# Altium project LimeSDR-XTRX_1v3.PrjPcb (part 7 of 8)

## Sheet 11_Power.SchDoc: Power
size A3; Organization: Lime Microsystems; Address1: Surrey Tech Centre; Address2: Guildford GU2 7YG; Address3: Surrey; Address4: United Kingdom; Revision: v1.3; SheetNumber: 11; SheetTotal: 11
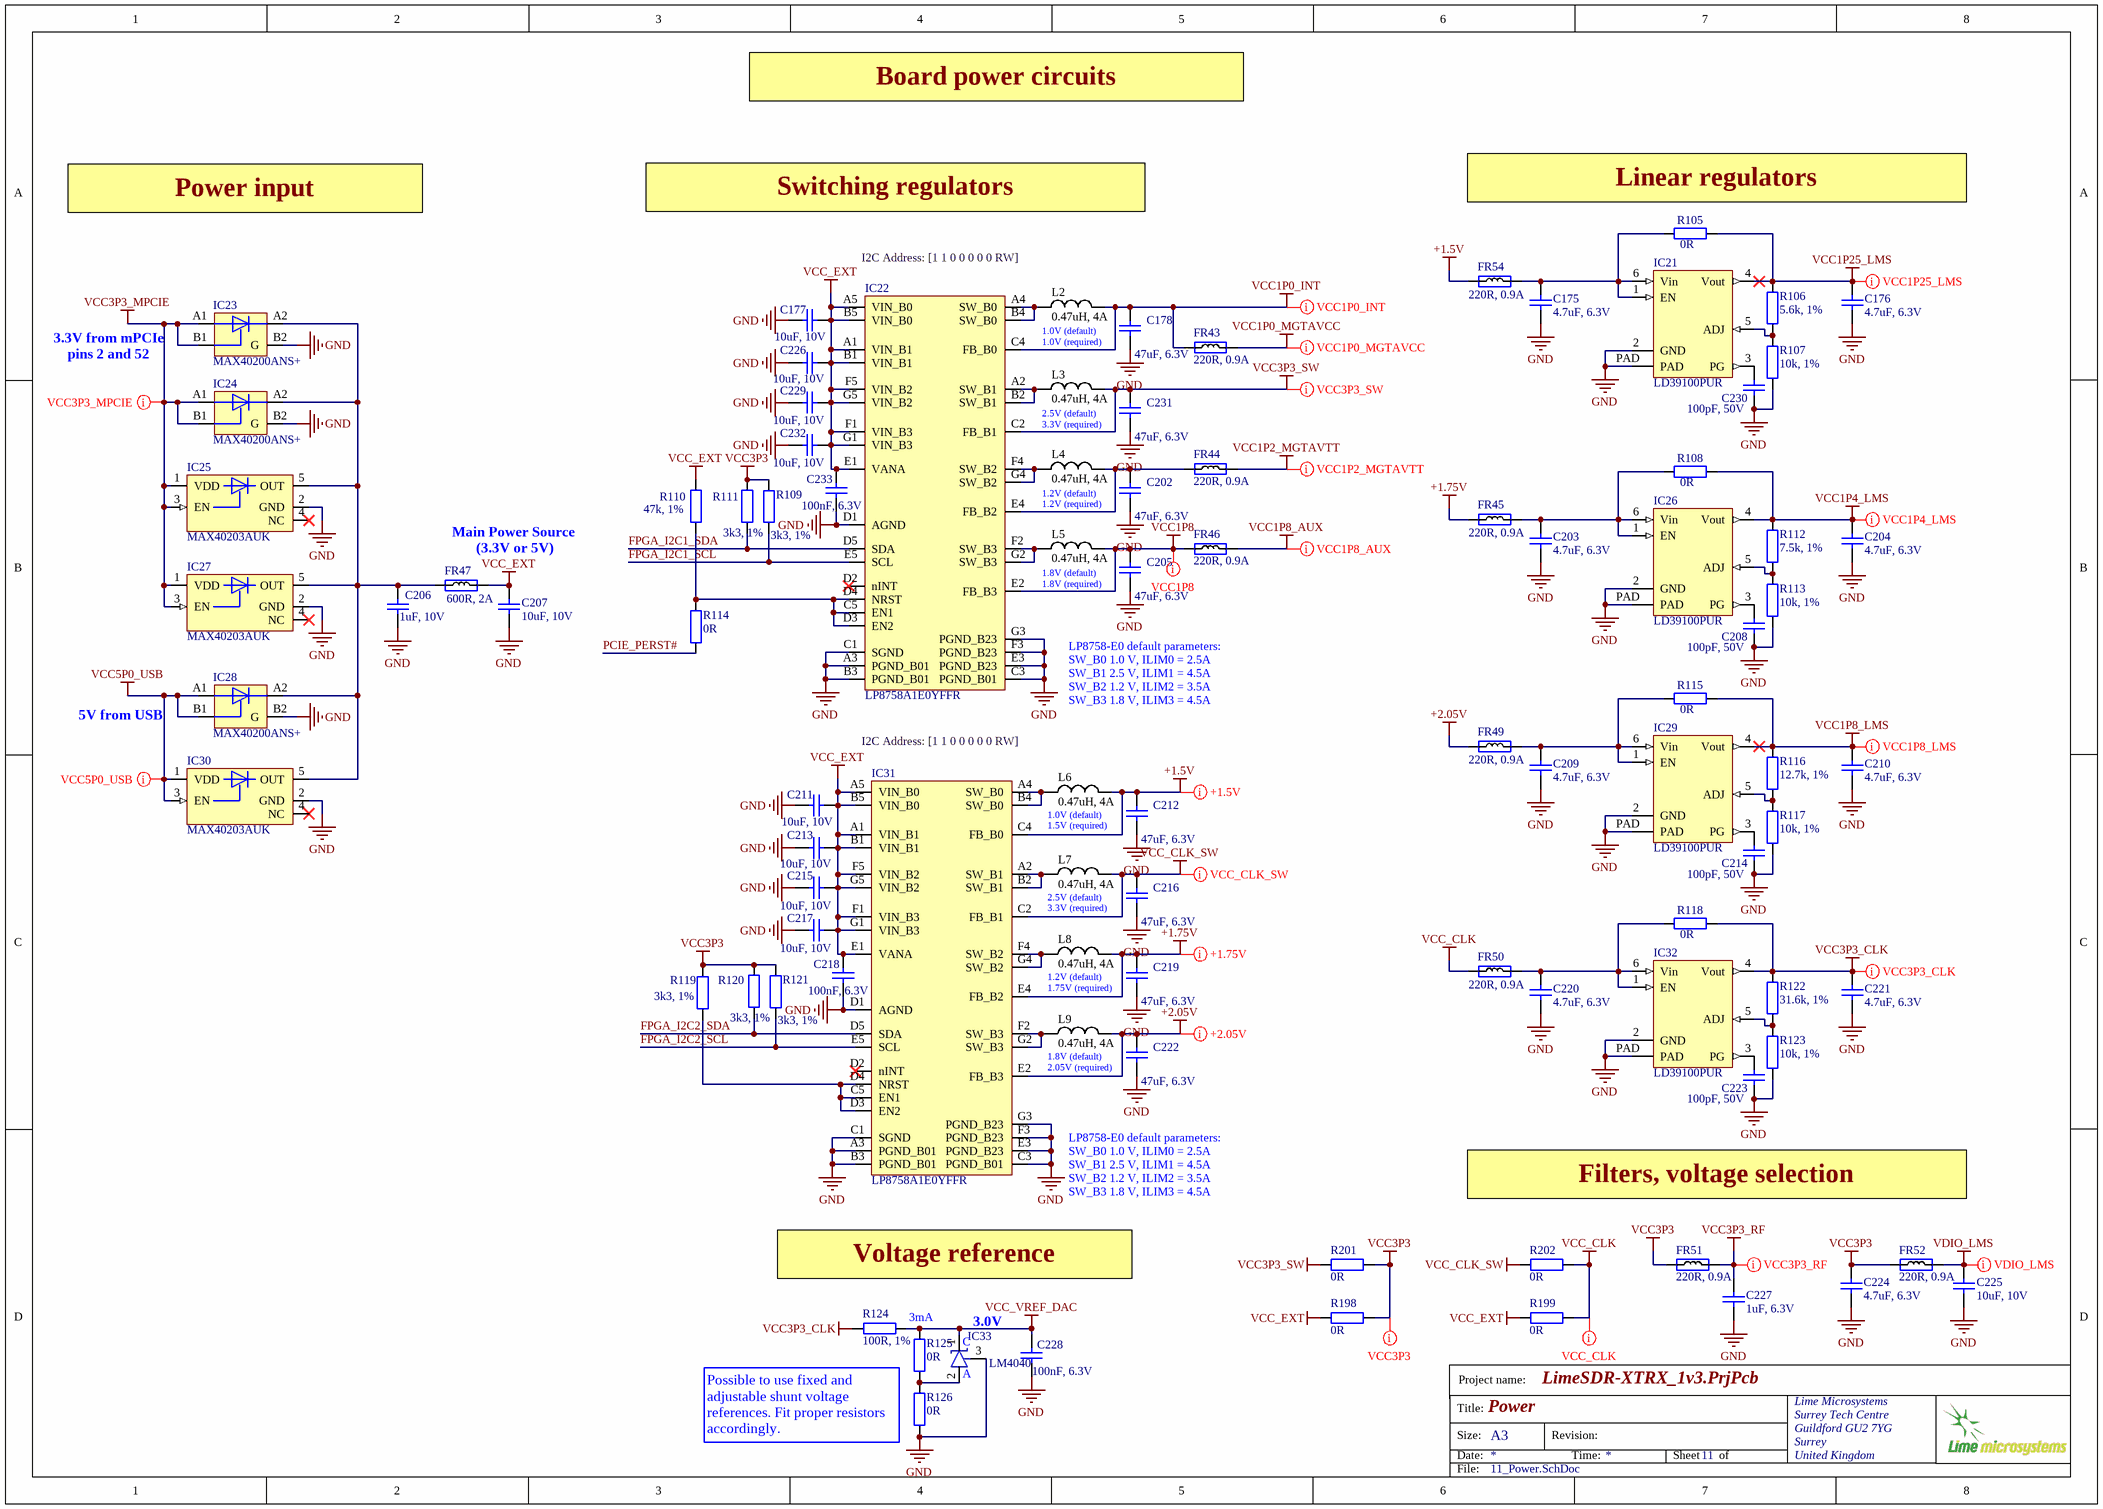
[diagram p10: 11_Power.SchDoc]

### Parts
C175  4.7uF, 6.3V  [CAP0402]
C176  4.7uF, 6.3V  [CAP0402]
C177  10uF, 10V  [CAP0603]
C178  47uF, 6.3V  [CAP0603]
C202  47uF, 6.3V  [CAP0603]
C203  4.7uF, 6.3V  [CAP0402]
C204  4.7uF, 6.3V  [CAP0402]
C205  47uF, 6.3V  [CAP0603]
C206  1uF, 10V  [CAP0402]
C207  10uF, 10V  [CAP0603]
C208  100pF, 50V  [CAP0201]
C209  4.7uF, 6.3V  [CAP0402]
C210  4.7uF, 6.3V  [CAP0402]
C211  10uF, 10V  [CAP0603]
C212  47uF, 6.3V  [CAP0603]
C213  10uF, 10V  [CAP0603]
C214  100pF, 50V  [CAP0201]
C215  10uF, 10V  [CAP0603]
C216  47uF, 6.3V  [CAP0603]
C217  10uF, 10V  [CAP0603]
C218  100nF, 6.3V  [CAP0201]
C219  47uF, 6.3V  [CAP0603]
C220  4.7uF, 6.3V  [CAP0402]
C221  4.7uF, 6.3V  [CAP0402]
C222  47uF, 6.3V  [CAP0603]
C223  100pF, 50V  [CAP0201]
C224  4.7uF, 6.3V  [CAP0402]
C225  10uF, 10V  [CAP0603]
C226  10uF, 10V  [CAP0603]
C227  1uF, 6.3V  [CAP0201]
C228  100nF, 6.3V  [CAP0201]
C229  10uF, 10V  [CAP0603]
C230  100pF, 50V  [CAP0201]
C231  47uF, 6.3V  [CAP0603]
C232  10uF, 10V  [CAP0603]
C233  100nF, 6.3V  [CAP0201]
FR43  220R, 0.9A  [RES0402]
FR44  220R, 0.9A  [RES0402]
FR45  220R, 0.9A  [RES0402]
FR46  220R, 0.9A  [RES0402]
FR47  600R, 2A  [RES0805]
FR49  220R, 0.9A  [RES0402]
FR50  220R, 0.9A  [RES0402]
FR51  220R, 0.9A  [RES0402]
FR52  220R, 0.9A  [RES0402]
FR54  220R, 0.9A  [RES0402]
IC21  LD39100PUR  [LD39100PUR]
IC22  LP8758A1E0YFFR  [LP8758A1E0YFFR_QUAD_DC-DC_35DSBGA]
IC23  MAX40200ANS+  [MAX40200ANS+_IDEAL_DIODE_4WLP]
IC24  MAX40200ANS+  [MAX40200ANS+_IDEAL_DIODE_4WLP]
IC25  MAX40203AUK  [SOT23-5_v1]
IC26  LD39100PUR  [LD39100PUR]
IC27  MAX40203AUK  [SOT23-5_v1]
IC28  MAX40200ANS+  [MAX40200ANS+_IDEAL_DIODE_4WLP]
IC29  LD39100PUR  [LD39100PUR]
IC30  MAX40203AUK  [SOT23-5_v1]
IC31  LP8758A1E0YFFR  [LP8758A1E0YFFR_QUAD_DC-DC_35DSBGA]
IC32  LD39100PUR  [LD39100PUR]
IC33  LM4040  [SOT23-3_v3]
L2  0.47uH, 4A  [IND0806]
L3  0.47uH, 4A  [IND0806]
L4  0.47uH, 4A  [IND0806]
L5  0.47uH, 4A  [IND0806]
L6  0.47uH, 4A  [IND0806]
L7  0.47uH, 4A  [IND0806]
L8  0.47uH, 4A  [IND0806]
L9  0.47uH, 4A  [IND0806]
R105  0R  [RES0201]
R106  5.6k, 1%  [RES0201]
R107  10k, 1%  [RES0201]
R108  0R  [RES0201]
R109  3k3, 1%  [RES0201]
R110  47k, 1%  [RES0201]
R111  3k3, 1%  [RES0201]
R112  7.5k, 1%  [RES0201]
R113  10k, 1%  [RES0201]
R114  0R  [RES0201]
R115  0R  [RES0201]
R116  12.7k, 1%  [RES0201]
R117  10k, 1%  [RES0201]
R118  0R  [RES0201]
R119  3k3, 1%  [RES0201]
R120  3k3, 1%  [RES0201]
R121  3k3, 1%  [RES0201]
R122  31.6k, 1%  [RES0201]
R123  10k, 1%  [RES0201]
R124  100R, 1%  [RES0201]
R125  0R  [RES0201]
R126  0R  [RES0201]
R198  0R  [RES0402]
R199  0R  [RES0402]
R201  0R  [RES0402]
R202  0R  [RES0402]

### Nets
+1.5V: C212.2 FR54.1 IC31.C4(FB_B0) L6.2
+1.75V: C219.2 FR45.1 IC31.E4(FB_B2) L8.2
+2.05V: C222.2 FR49.1 IC31.E2(FB_B3) L9.2
GND: C175.1 C176.1 C177.1 C178.1 C202.1 C203.1 C204.1 C205.1 C206.1 C207.1 C208.1 C209.1 C210.1 C211.1 C212.1 C213.1 C214.1 C215.1 C216.1 C217.1 C218.2 C219.1 C220.1 C221.1 C222.1 C223.1 C224.1 C225.1 C226.1 C227.2 C228.2 C229.1 C230.1 C231.1 C232.1 C233.2 IC21.2(GND) IC21.PAD IC22.A3(PGND_B01) IC22.B3(PGND_B01) IC22.C1(SGND) IC22.C3(PGND_B01) IC22.D1(AGND) IC22.E3(PGND_B23) IC22.F3(PGND_B23) IC22.G3(PGND_B23) IC23.B2(G) IC24.B2(G) IC25.2(GND) IC26.2(GND) IC26.PAD IC27.2(GND) IC28.B2(G) IC29.2(GND) IC29.PAD IC30.2(GND) IC31.A3(PGND_B01) IC31.B3(PGND_B01) IC31.C1(SGND) IC31.C3(PGND_B01) IC31.D1(AGND) IC31.E3(PGND_B23) IC31.F3(PGND_B23) IC31.G3(PGND_B23) IC32.2(GND) IC32.PAD IC33.3(NC/A) R107.2 R113.2 R117.2 R123.2 R126.2
VCC1P0_INT: C178.2 FR43.1 IC22.C4(FB_B0) L2.2
VCC1P0_MGTAVCC: FR43.2
VCC1P2_MGTAVTT: FR44.2
VCC1P4_LMS: C204.2 IC26.4(Vout) R108.2 R112.1
VCC1P8: C205.2 FR46.1 IC22.E2(FB_B3) L5.2
VCC1P8_AUX: FR46.2
VCC1P8_LMS: C210.2 IC29.4(Vout) R115.2 R116.1
VCC1P25_LMS: C176.2 IC21.4(Vout) R105.2 R106.1
VCC3P3: C224.2 FR51.1 FR52.1 R109.1 R111.1 R119.1 R120.1 R121.1 R198.2 R201.2
VCC3P3_CLK: C221.2 IC32.4(Vout) R118.2 R122.1 R124.2
VCC3P3_MPCIE: IC23.A1(VDD) IC23.B1(EN) IC24.A1(VDD) IC24.B1(EN) IC25.1(VDD) IC25.3(EN) IC27.1(VDD) IC27.3(EN)
VCC3P3_RF: C227.1 FR51.2
VCC3P3_SW: C231.2 IC22.C2(FB_B1) L3.2 R201.1
VCC5P0_USB: IC28.A1(VDD) IC28.B1(EN) IC30.1(VDD) IC30.3(EN)
VCC_CLK: FR50.1 R199.2 R202.2
VCC_CLK_SW: C216.2 IC31.C2(FB_B1) L7.2 R202.1
VCC_EXT: C177.2 C207.2 C211.2 C213.2 C215.2 C217.2 C218.1 C226.2 C229.2 C232.2 C233.1 FR47.2 IC22.A1(VIN_B1) IC22.A5(VIN_B0) IC22.B1(VIN_B1) IC22.B5(VIN_B0) IC22.E1(VANA) IC22.F1(VIN_B3) IC22.F5(VIN_B2) IC22.G1(VIN_B3) IC22.G5(VIN_B2) IC31.A1(VIN_B1) IC31.A5(VIN_B0) IC31.B1(VIN_B1) IC31.B5(VIN_B0) IC31.E1(VANA) IC31.F1(VIN_B3) IC31.F5(VIN_B2) IC31.G1(VIN_B3) IC31.G5(VIN_B2) R110.1 R198.1 R199.1
VCC_VREF_DAC: C228.1 IC33.1(K) R124.1 R125.1
VDIO_LMS: C225.2 FR52.2
FPGA_I2C1_SCL: IC22.E5(SCL) R109.2
FPGA_I2C1_SDA: IC22.D5(SDA) R111.2
FPGA_I2C2_SCL: IC31.E5(SCL) R121.2
FPGA_I2C2_SDA: IC31.D5(SDA) R120.2
PCIE_PERST#: R114.1
NetC175_2: C175.2 FR54.2 IC21.1(EN) IC21.6(Vin) R105.1
NetC202_2: C202.2 FR44.1 IC22.E4(FB_B2) L4.2
NetC203_2: C203.2 FR45.2 IC26.1(EN) IC26.6(Vin) R108.1
NetC206_2: C206.2 FR47.1 IC23.A2(OUT) IC24.A2(OUT) IC25.5(OUT) IC27.5(OUT) IC28.A2(OUT) IC30.5(OUT)
NetC208_2: C208.2 IC26.3(PG)
NetC209_2: C209.2 FR49.2 IC29.1(EN) IC29.6(Vin) R115.1
NetC214_2: C214.2 IC29.3(PG)
NetC220_2: C220.2 FR50.2 IC32.1(EN) IC32.6(Vin) R118.1
NetC223_2: C223.2 IC32.3(PG)
NetC230_2: C230.2 IC21.3(PG)
NetIC21_5: IC21.5(ADJ) R106.2 R107.1
NetIC22_A2: IC22.A2(SW_B1) IC22.B2(SW_B1) L3.1
NetIC22_A4: IC22.A4(SW_B0) IC22.B4(SW_B0) L2.1
NetIC22_C5: IC22.C5(EN1) IC22.D3(EN2) IC22.D4(NRST) R110.2 R114.2
NetIC22_F2: IC22.F2(SW_B3) IC22.G2(SW_B3) L5.1
NetIC22_F4: IC22.F4(SW_B2) IC22.G4(SW_B2) L4.1
NetIC26_5: IC26.5(ADJ) R112.2 R113.1
NetIC29_5: IC29.5(ADJ) R116.2 R117.1
NetIC31_A2: IC31.A2(SW_B1) IC31.B2(SW_B1) L7.1
NetIC31_A4: IC31.A4(SW_B0) IC31.B4(SW_B0) L6.1
NetIC31_C5: IC31.C5(EN1) IC31.D3(EN2) IC31.D4(NRST) R119.2
NetIC31_F2: IC31.F2(SW_B3) IC31.G2(SW_B3) L9.1
NetIC31_F4: IC31.F4(SW_B2) IC31.G4(SW_B2) L8.1
NetIC32_5: IC32.5(ADJ) R122.2 R123.1
NetIC33_2: IC33.2(A) R125.2 R126.1

Not connected (* = marked no-connect by the designer): IC22 D2(nINT)*; IC25 4(NC)*; IC27 4(NC)*; IC30 4(NC)*; IC31 D2(nINT)*

### Layout directives
net class VDIO_LMS: VDIO_LMS
net class VCC1P25_LMS: VCC1P25_LMS
net class VCC1P4_LMS: VCC1P4_LMS
net class VCC1P8_LMS: VCC1P8_LMS
net class VCC3P3_CLK: VCC3P3_CLK
net class +1.5V: +1.5V
net class VCC_CLK_SW: VCC_CLK_SW
net class +1.75V: +1.75V
net class +2.05V: +2.05V
net class VCC1P8_AUX: VCC1P8_AUX
net class VCC1P2_MGTAVTT: VCC1P2_MGTAVTT
net class VCC3P3_SW: VCC3P3_SW
net class VCC1P0_MGTAVCC: VCC1P0_MGTAVCC
net class VCC1P0_INT: VCC1P0_INT
net class VCC3P3_MPCIE: VCC3P3_MPCIE
net class VCC5P0_USB: VCC5P0_USB
net class VCC3P3_RF: VCC3P3_RF
net class VCC_CLK: VCC_CLK
net class VCC3P3: VCC3P3
net class VCC1P8: VCC1P8

### Notes on the sheet
- Board power circuits
- Power input
- Switching regulators
- (near R105) Linear regulators
- I2C Address: [1 1 0 0 0 0 0 RW]
- 3.3V from mPCIe pins 2 and 52
- 1.0V (default)
  1.0V (required)
- 2.5V (default)
  3.3V (required)
- 1.2V (default)
  1.2V (required)
- (near FR47) Main Power Source
  (3.3V or 5V)
- 1.8V (default)
  1.8V (required)
- LP8758-E0 default parameters:
  SW_B0 1.0 V, ILIM0 = 2.5A
  SW_B1 2.5 V, ILIM1 = 4.5A
  SW_B2 1.2 V, ILIM2 = 3.5A
  SW_B3 1.8 V, ILIM3 = 4.5A
- 5V from USB
- 1.0V (default)
  1.5V (required)
- 1.2V (default)
  1.75V (required)
- 1.8V (default)
  2.05V (required)
- Filters, voltage selection
- Voltage reference
- 3mA
- 3.0V
- (near IC33) A
- (near IC33) C
- Possible to use fixed and adjustable shunt voltage references. Fit proper resistors accordingly.
- Project name:
- Title:
- Size:
- Date:
- A3
- Revision:
- Time:
- Sheet
- of
- File:

### Library data of the parts
C175 C176 C203 C204 C209 C210 C220 C221 C224 = Cap_0402: as C107 on sheet 08_FPGA; Lead Style: -; Ratings: -; Height - Seated (Max): -; Thickness (Max): 0.022" (0.55mm); Voltage - Rated: 6.3V; Packaging: Cut Tape (CT); Lead Spacing: -; Category: Capacitors; Supplier Part Number 1: 490-5408-1-ND; Applications: General Purpose; Operating Temperature: -55°C ~ 85°C; Mounting Type: Surface Mount, MLCC; Features: Derating Recommended; RoHS: RoHS Compliant; Supplier 1: Digi-Key; Package / Case: 0402 (1005 Metric); Size / Dimension: 0.039" L x 0.020" W (1.00mm x 0.50mm); Value: 4.7uF, 6.3V
C177 = Cap_0603: Part Description: 10 µF ±20% 10V Ceramic Capacitor X5R 0603 (1608 Metric); Manufacturer: Murata; Manufacturer Part Number 1: GRM188R61A106ME69D; Material: Ceramic; Tolerance: 20%; Dielectric: X5R; Value: 10uF, 10V; ComponentLink1URL: http://search.murata.co.jp/Ceramy/image/img/A01X/G101/ENG/GRM188R61C106MAAL-01.pdf?src-supplier=Digi-Key; ComponentLink1Description: http://search.murata.co.jp/Ceramy/image/img/A01X/G101/ENG/GRM188R61C106MAAL-01.pdf?src-supplier=Digi-Key; ComponentLink2URL: https://search.murata.co.jp/Ceramy/image/img/A01X/G101/ENG/GRM188R61C106MAAL-01.pdf?src-supplier=Digi-Key; ComponentLink2Description: https://search.murata.co.jp/Ceramy/image/img/A01X/G101/ENG/GRM188R61C106MAAL-01.pdf?src-supplier=Digi-Key; ComponentLink3URL: http://search.murata.co.jp/Ceramy/image/img/A01X/partnumbering_e_01.pdf?src-supplier=Digi-Key; ComponentLink3Description: http://search.murata.co.jp/Ceramy/image/img/A01X/partnumbering_e_01.pdf?src-supplier=Digi-Key; Supplier 1: Digi-Key; Supplier Part Number 1: 490-10475-1-ND; Stock 1: 820978; Pricing 1: 1=0,16000, 10=0,11200, 50=0,06360, 100=0,05270, 500=0,03696, 1000=0,03060 (USD); RoHS: Yes; Mount: Surface Mount; Case/Package: 0603; Case Code (Metric): 1608; Case Code (Imperial): 0603; Weight: 0.000222oz; Min Operating Temperature: -55°C; Max Operating Temperature: 85°C; Packaging: Tape and Reel; Capacitance: 10uF; Voltage Rating: 10V; Termination: SMD/SMT; Voltage Rating (DC): 10V; Package Quantity: 4000; Series: GRM; Length: 1.6mm; Width: 0.8mm; Height: 0.8mm; Thickness: 0.035inch; Depth: 0.8mm; Lead Free: Lead Free; RoHS Compliant: Yes; ComponentLink4URL: http://www.farnell.com/datasheets/1872210.pdf?src-supplier=Farnell; ComponentLink4Description: http://www.farnell.com/datasheets/1872210.pdf?src-supplier=Farnell; ComponentLink5URL: http://www.mouser.com/ds/2/281/c02e-2905.pdf?src-supplier=Mouser; ComponentLink5Description: http://www.mouser.com/ds/2/281/c02e-2905.pdf?src-supplier=Mouser; ComponentLink6URL: http://www.farnell.com/datasheets/1872210.pdf?src-supplier=Newark; ComponentLink6Description: http://www.farnell.com/datasheets/1872210.pdf?src-supplier=Newark; ComponentLink7URL: http://www.farnell.com/datasheets/2048014.pdf?src-supplier=Element14; ComponentLink7Description: http://www.farnell.com/datasheets/2048014.pdf?src-supplier=Element14; ComponentLink8URL: http://www.farnell.com/datasheets/1872210.pdf?src-supplier=Element14; ComponentLink8Description: http://www.farnell.com/datasheets/1872210.pdf?src-supplier=Element14; ComponentLink9URL: http://search.murata.co.jp/Ceramy/image/img/A01X/G101/ENG/GRM188R61A106ME69-01.pdf?src-supplier=Digi-Key; ComponentLink9Description: http://search.murata.co.jp/Ceramy/image/img/A01X/G101/ENG/GRM188R61A106ME69-01.pdf?src-supplier=Digi-Key
C178 C202 C205 C212 C216 C219 C222 C231 = Cap_0603: as C116 on sheet 08_FPGA; Value: 47uF, 6.3V; Supplier 1: Digi-Key; Supplier Part Number 1: 490-13247-1-ND; Stock 1: 731453; Pricing 1: 1=0,45000, 10=0,31900, 50=0,24120, 100=0,21000, 500=0,15556, 1000=0,13223 (USD); RoHS: Yes; Mount: Surface Mount; Case/Package: 0603; Case Code (Metric): 1608; Case Code (Imperial): 0603; Min Operating Temperature: -55°C; Max Operating Temperature: 85°C; Packaging: Tape and Reel; Capacitance: 47uF; Voltage Rating: 6.3V; Voltage Rating (DC): 6.3V; Length: 0.063inch; Width: 0.031inch; Thickness: 0.039inch; RoHS Compliant: Yes; ComponentLink1URL: http://search.murata.co.jp/Ceramy/image/img/A01X/G101/ENG/GRM188R60J476ME15-01.pdf?src-supplier=Digi-Key; ComponentLink1Description: http://search.murata.co.jp/Ceramy/image/img/A01X/G101/ENG/GRM188R60J476ME15-01.pdf?src-supplier=Digi-Key; ComponentLink2URL: https://www.murata.com/~/media/webrenewal/support/library/catalog/products/capacitor/mlcc/c02e.ashx?la=en-us&src-supplier=Digi-Key; ComponentLink2Description: https://www.murata.com/~/media/webrenewal/support/library/catalog/products/capacitor/mlcc/c02e.ashx?la=en-us&src-supplier=Digi-Key
C206 = Cap_0402: as C186 on sheet 09_Misc; Value: 1uF, 10V; Supplier 1: Digi-Key; Supplier Part Number 1: 445-9066-1-ND; MSL: -; RoHS: YES
C207 C211 C213 C215 C217 C225 C226 C229 C232 = Cap_0603: Part Description: 10 µF ±20% 10V Ceramic Capacitor X5R 0603 (1608 Metric); Manufacturer: Murata; Manufacturer Part Number 1: GRM188R61A106ME69D; Dielectric: X5R; Material: Ceramic; Tolerance: 20%; Value: 10uF, 10V; ComponentLink1Description: http://search.murata.co.jp/Ceramy/image/img/A01X/G101/ENG/GRM188R61C106MAAL-01.pdf?src-supplier=Digi-Key; ComponentLink1URL: http://search.murata.co.jp/Ceramy/image/img/A01X/G101/ENG/GRM188R61C106MAAL-01.pdf?src-supplier=Digi-Key; ComponentLink2Description: https://search.murata.co.jp/Ceramy/image/img/A01X/G101/ENG/GRM188R61C106MAAL-01.pdf?src-supplier=Digi-Key; ComponentLink2URL: https://search.murata.co.jp/Ceramy/image/img/A01X/G101/ENG/GRM188R61C106MAAL-01.pdf?src-supplier=Digi-Key; ComponentLink3Description: http://search.murata.co.jp/Ceramy/image/img/A01X/partnumbering_e_01.pdf?src-supplier=Digi-Key; ComponentLink3URL: http://search.murata.co.jp/Ceramy/image/img/A01X/partnumbering_e_01.pdf?src-supplier=Digi-Key; Capacitance: 10uF; Case/Package: 0603; Case Code (Imperial): 0603; Case Code (Metric): 1608; ComponentLink4Description: http://www.farnell.com/datasheets/1872210.pdf?src-supplier=Farnell; ComponentLink4URL: http://www.farnell.com/datasheets/1872210.pdf?src-supplier=Farnell; ComponentLink5Description: http://www.mouser.com/ds/2/281/c02e-2905.pdf?src-supplier=Mouser; ComponentLink5URL: http://www.mouser.com/ds/2/281/c02e-2905.pdf?src-supplier=Mouser; ComponentLink6Description: http://www.farnell.com/datasheets/1872210.pdf?src-supplier=Newark; ComponentLink6URL: http://www.farnell.com/datasheets/1872210.pdf?src-supplier=Newark; ComponentLink7Description: http://www.farnell.com/datasheets/2048014.pdf?src-supplier=Element14; ComponentLink7URL: http://www.farnell.com/datasheets/2048014.pdf?src-supplier=Element14; ComponentLink8Description: http://www.farnell.com/datasheets/1872210.pdf?src-supplier=Element14; ComponentLink8URL: http://www.farnell.com/datasheets/1872210.pdf?src-supplier=Element14; ComponentLink9Description: http://search.murata.co.jp/Ceramy/image/img/A01X/G101/ENG/GRM188R61A106ME69-01.pdf?src-supplier=Digi-Key; ComponentLink9URL: http://search.murata.co.jp/Ceramy/image/img/A01X/G101/ENG/GRM188R61A106ME69-01.pdf?src-supplier=Digi-Key; Depth: 0.8mm; Height: 0.8mm; Lead Free: Lead Free; Length: 1.6mm; Max Operating Temperature: 85°C; Min Operating Temperature: -55°C; Mount: Surface Mount; Package Quantity: 4000; Packaging: Tape and Reel; Pricing 1: 1=0,16000, 10=0,11200, 50=0,06360, 100=0,05270, 500=0,03696, 1000=0,03060 (USD); RoHS: Yes; RoHS Compliant: Yes; Series: GRM; Stock 1: 820978; Supplier 1: Digi-Key; Supplier Part Number 1: 490-10475-1-ND; Termination: SMD/SMT; Thickness: 0.035inch; Voltage Rating (DC): 10V; Voltage Rating: 10V; Weight: 0.000222oz; Width: 0.8mm
C208 C214 C223 C230 = Cap_0402: as C170 on sheet 09_Misc; Value: 100pF, 50V; Capacitance: 100pF; Case/Package: 0201; Case Code (Imperial): 0201; Case Code (Metric): 0603; ComponentLink1Description: https://datasheet.ciiva.com/24217/c0603c0g1h101j030ba-264106-24217425.pdf?src-supplier=Mouser; ComponentLink1URL: https://datasheet.ciiva.com/24217/c0603c0g1h101j030ba-264106-24217425.pdf?src-supplier=Mouser; ComponentLink2Description: https://datasheet.ciiva.com/16205/mlcc-commercial-general-en-16205590.pdf?src-supplier=Future+Electronics; ComponentLink2URL: https://datasheet.ciiva.com/16205/mlcc-commercial-general-en-16205590.pdf?src-supplier=Future+Electronics; ComponentLink3Description: https://datasheet.ciiva.com/6250/tdkmlcccaprange-6250351.pdf?src-supplier=Digi-Key; ComponentLink3URL: https://datasheet.ciiva.com/6250/tdkmlcccaprange-6250351.pdf?src-supplier=Digi-Key; Construction: Flat; Depth: 0.3mm; Height: 0.3mm; Lead Free: Lead Free; Length: 0.6mm; Max Operating Temperature: 125°C; Min Operating Temperature: -55°C; Mount: Surface Mount; Number of Pins: 2; Package Quantity: 1; Packaging: Tape and Reel; Pricing 1: 1=0,10000, 10=0,06000, 50=0,03280, 100=0,02670, 500=0,01908, 1000=0,01500, 2500=0,01364, 5000=0,01254 (USD); Reach SVHC Compliant: Yes; RoHS: Yes; RoHS Compliant: Yes; Series: C; Stock 1: 367528; Supplier 1: Digi-Key; Supplier Part Number 1: 445-1786-1-ND; Termination: SMD/SMT; Thickness: 0.013inch; Voltage: 50V; Voltage Rating (DC): 50V; Voltage Rating: 50V; Weight: 6E-06oz; Width: 0.012inch
C218 C228 C233 = Cap_0402: as C95-C97 on sheet 08_FPGA; Value: 100nF, 6.3V; Capacitance: 100nF; Case/Package: 0201; Case Code (Imperial): 0201; Case Code (Metric): 0603; ComponentLink5Description: https://datasheet.ciiva.com/25788/cl03a104mp3nnnc-25788272.pdf?src-supplier=Digi-Key; ComponentLink5URL: https://datasheet.ciiva.com/25788/cl03a104mp3nnnc-25788272.pdf?src-supplier=Digi-Key; Length: 0.024inch; Max Operating Temperature: 85°C; Min Operating Temperature: -55°C; Mount: Surface Mount; Package Quantity: 1; Packaging: Tape and Reel; Pricing 1: 1=0,10000, 10=0,03000, 50=0,01640, 100=0,01330, 500=0,00950, 1000=0,00747, 2500=0,00679, 5000=0,00625 (USD); RoHS: Yes; RoHS Compliant: Yes; Series: CL; Stock 1: 3817176; Supplier 1: Digi-Key; Supplier Part Number 1: 1276-1321-1-ND; Thickness: 0.013inch; Voltage Rating: 10V; Width: 0.012inch
C227 = Cap_0402: as C180 on sheet 09_Misc; Supplier 1: Digi-Key; Supplier Part Number 1: 587-5864-2-ND; Applications: General Purpose; Features: -; Lead Style: -; Ratings: -; Thickness (Max): -; Lead Spacing: -; Height - Seated (Max): -; Size / Dimension: 0.024" L x 0.012" W (0.60mm x 0.30mm); Mounting Type: Surface Mount, MLCC; Operating Temperature: -55°C ~ 85°C; Package / Case: 0201 (0603 Metric); Packaging: Cut Tape (CT); Voltage - Rated: 6.3V; Category: Capacitors; RoHS: RoHS Compliant
FR43-FR46 FR49-FR52 FR54 = Ferrite: as FR38 on sheet 09_Misc; Supplier 1: Digi-Key; Package / Case: 0402 (1005 Metric); Category: Filters; Supplier Part Number 1: 445-9329-2-ND; Value: 220R, 0.9A
FR47 = Ferrite: Manufacturer Part Number 1: MPZ2012S601AT000; Manufacturer: TDK Corporation; Part Description: FERRITE BEAD 600 OHM 0805 1LN; Filter Type: Differential Mode - Single; Impedance @ Frequency: 600 Ohm @ 100MHz; DC Resistance (DCR): 100 mOhm Max; Supplier 1: Digi-Key; Supplier Part Number 1: 445-2206-2-ND; Mounting Type: Surface Mount; RoHS: RoHS Compliant; Height (Max): 0.041" (1.05mm); Packaging: Tape & Reel (TR); Category: Filters; Current Rating: 2A; Package / Case: 0805 (2012 Metric); Size / Dimension: 0.079" L x 0.049" W (2.00mm x 1.25mm)
IC21 IC26 IC29 IC32 = LD39100PUR: Manufacturer: STMicroelectronics; Part Description: Linear Voltage Regulator IC Positive Adjustable Output 0.8 V ~ 4.5 V 1A 6-DFN (3x3); Output Configuration: Positive; Output Type: Adjustable; Voltage - Input (Max): 5.5V; Voltage - Output (Min/Fixed): 0.8V; Voltage - Output (Max): 4.6V; Voltage Dropout (Max): 0.4V @ 1A; Current - Output: 1A; Current - Supply: 50µA ~ 300µA; PSRR: 70dB ~ 65dB (1kHz ~ 10kHz); Control Features: Enable, Power Good; Protection Features: Over Current, Over Temperature, Short Circuit; Supplier 1: Digi-Key; Manufacturer Part Number 1: LD39100PUR; RoHS: RoHS Compliant; Category: Integrated Circuits (ICs); Stock 1: 27970; Pricing 1: 1=0.85, 10=0.76, 100=0.5923, 500=0.48926, 1000=0.38625 (USD); Packaging: Cut Tape (CT); Part Status: Active; Operating Temperature: -40°C ~ 125°C; Mounting Type: Surface Mount; Package / Case: 6-VDFN Exposed Pad; Supplier Device Package: 6-DFN (3x3); ComponentLink1URL: http://www.st.com/content/ccc/resource/technical/document/datasheet/72/02/e5/ee/df/36/40/5e/CD00233788.pdf/files/CD00233788.pdf/jcr:content/translations/en.CD00233788.pdf; ComponentLink1Description: http://www.st.com/content/ccc/resource/technical/document/datasheet/72/02/e5/ee/df/36/40/5e/CD00233788.pdf/files/CD00233788.pdf/jcr:content/translations/en.CD00233788.pdf; Supplier Part Number 1: 497-11013-1-ND
IC22 IC31 = LP8758A1E0YFFR_QUAD_DC-DC: Part Description: Buck Switching Regulator IC Positive Programmable 0.5V 4 Output 4A 35-UFBGA, DSBGA; Manufacturer: Texas Instruments; Number of Outputs: 4; Min Input Voltage: 2.5V; Max Input Voltage: 5.5V; Min Output Voltage: 500mV; Max Output Voltage: 3.36V; Output Current: 4A; Switching Frequency: 3MHz; Synchronous Rectifier: Yes; Quiescent Current: 6uA; Output Configuration: Positive; Supplier 1: Digi-Key; Supplier Part Number 1: 296-47808-1-ND; Manufacturer Part Number 1: LP8758A1E0YFFR; Stock 1: 1; Pricing 1: 1=6,12000, 10=5,49500, 25=5,19440, 100=4,50190, 250=4,27104, 500=3,83240, 1000=3,48480 (USD); RoHS: Yes; Mount: Surface Mount; Case/Package: Module; Min Operating Temperature: -40°C; Max Operating Temperature: 85°C; Packaging: Tape and Reel; Lead Free: Lead Free; RoHS Compliant: Yes; ComponentLink1URL: http://www.ti.com/general/docs/suppproductinfo.tsp?distId=10&amp;gotoUrl=http%3A%2F%2Fwww.ti.com%2Flit%2Fgpn%2Flp8758-e0&src-supplier=Digi-Key; ComponentLink1Description: http://www.ti.com/general/docs/suppproductinfo.tsp?distId=10&amp;gotoUrl=http%3A%2F%2Fwww.ti.com%2Flit%2Fgpn%2Flp8758-e0&src-supplier=Digi-Key; ComponentLink2URL: http://www.ti.com/lit/gpn/lp8758-e0?src-supplier=Mouser; ComponentLink2Description: http://www.ti.com/lit/gpn/lp8758-e0?src-supplier=Mouser; ComponentLink3URL: http://www.ti.com/lit/ds/symlink/lp8758-e0.pdf?src-supplier=Digi-Key; ComponentLink3Description: http://www.ti.com/lit/ds/symlink/lp8758-e0.pdf?src-supplier=Digi-Key
IC23 IC24 IC28 = MAX40200ANS+_IDEAL_DIODE: Part Description: OR Controller Source Selector Switch P-Channel 1:1 4-WLP (0.73x0.73); Manufacturer: Maxim; Turn-On Delay Time: 65us; Turn-Off Delay Time: 1.6ms; Max Output Current: 1.2A; Operating Supply Current: 7uA; Supplier 1: Digi-Key; Supplier Part Number 1: MAX40200ANS+-ND; Manufacturer Part Number 1: MAX40200ANS+; Stock 1: 0; RoHS: Yes; Mount: Surface Mount; Min Operating Temperature: -40°C; Max Operating Temperature: 125°C; Packaging: Rail/Tube; ComponentLink1URL: https://datasheets.maximintegrated.com/en/ds/MAX40200.pdf?src-supplier=Digi-Key; ComponentLink1Description: https://datasheets.maximintegrated.com/en/ds/MAX40200.pdf?src-supplier=Digi-Key
IC25 IC27 IC30 = MAX40203AUK+T_ideal_diode: Part Description: OR Controller Source Selector Switch P-Channel 1:1 SOT-23-5; Manufacturer: Maxim; Supplier 1: Digi-Key; Supplier Part Number 1: 175-MAX40203AUK+TCT-ND; Manufacturer Part Number 1: MAX40203AUK+T; Stock 1: 0; RoHS: Yes
IC33 = VOLTAGE_REFERENCE_UNIVERSAL: Part Description: Shunt Voltage Reference IC Fixed 3V V ±0.5% 15 mA SOT-23-3; Manufacturer: Diodes; Manufacturer Part Number 1: LM4040C30FTA; Output Voltage: 3V; Max Output Current: 15mA; Tolerance: 0.5%; Number of Channels: 1; Temperature Coefficient: 100ppm/°C; Cathode Current: 70uA; Reference Type: Shunt; Output Type: Fixed; ComponentLink1URL: https://datasheet.ciiva.com/1177/1643148-1177233.pdf?src-supplier=Avnet; ComponentLink1Description: https://datasheet.ciiva.com/1177/1643148-1177233.pdf?src-supplier=Avnet; ComponentLink2Description: https://datasheet.ciiva.com/30002/as431-30002029.pdf?src-supplier=Avnet; ComponentLink2URL: https://datasheet.ciiva.com/30002/as431-30002029.pdf?src-supplier=Avnet; ComponentLink3Description: https://datasheet.ciiva.com/29572/as431-29572149.pdf?src-supplier=Digi-Key; ComponentLink3URL: https://datasheet.ciiva.com/29572/as431-29572149.pdf?src-supplier=Digi-Key; ComponentLink4Description: https://datasheet.ciiva.com/29572/as431-29572150.pdf?src-supplier=Digi-Key; ComponentLink4URL: https://datasheet.ciiva.com/29572/as431-29572150.pdf?src-supplier=Digi-Key; Supplier 1: Digi-Key; Supplier Part Number 1: LM4040C30FTADICT-ND; Stock 1: 39055; Pricing 1: 1=0,59, 10=0,518, 25=0,4864, 100=0,3969, 250=0,36864, 500=0,31374, 1000=0,25099 (USD); RoHS: No; Mount: Surface Mount; Case/Package: SOT-23; Weight: 0.000282oz; Min Operating Temperature: -40°C; Max Operating Temperature: 125°C; Packaging: Tape and Reel; Package Quantity: 3000; Current Rating: 15mA; Min Output Voltage: 3V; Output Current: 15mA; Reference Voltage: 3V; Series: LM4040; Length: 3.04mm; Width: 1.4mm; Height: 1.02mm; Radiation Hardening: No; Lead Free: Lead Free; RoHS Compliant: No; ComponentLink5URL: https://datasheet.ciiva.com/8132/lm4040-8132551.pdf?src-supplier=Avnet; ComponentLink5Description: https://datasheet.ciiva.com/8132/lm4040-8132551.pdf?src-supplier=Avnet; Value: LM4040
L2-L9 = Inductor: Part Description: 470 nH Shielded Drum Core, Wirewound Inductor 2.81 A 41mOhm Max 0806 (2016 Metric); Manufacturer: TDK; Manufacturer Part Number 1: VLS201610HBX-R47M-1; Core Material: Metal; Inductance Tolerance: 20%; Inductance: 470nH; Current Rating: 2.81A; Saturation Current: 3.5A; Shielding: Shielded; DC Resistance (DCR): 41mR; Test Frequency: 1MHz; RMS Current (Irms): 3.3A; Value: 0.47uH, 4A; Supplier 1: Digi-Key; Supplier Part Number 1: 445-172395-1-ND; Stock 1: 1817; Pricing 1: 1=0,35000, 10=0,31200, 25=0,27320, 50=0,23400, 100=0,21450, 250=0,19504, 500=0,18334, 1000=0,14043 (USD); RoHS: Yes; Mount: Surface Mount; Case/Package: 0806; Case Code (Metric): 2016; Case Code (Imperial): 0806; Min Operating Temperature: -40°C; Max Operating Temperature: 105°C; Packaging: Cut Tape; Resistor Type: Wirewound; Tolerance: 20%; Length: 0.079inch; Width: 0.063inch; Height - Seated (Max): 0.039inch; Reach SVHC Compliant: No SVHC; RoHS Compliant: Yes; ComponentLink1URL: http://www.farnell.com/datasheets/2130008.pdf?src-supplier=Farnell; ComponentLink1Description: http://www.farnell.com/datasheets/2130008.pdf?src-supplier=Farnell; ComponentLink2URL: http://www.farnell.com/datasheets/1866267.pdf?src-supplier=Element14; ComponentLink2Description: http://www.farnell.com/datasheets/1866267.pdf?src-supplier=Element14; ComponentLink3URL: http://www.farnell.com/datasheets/2130008.pdf?src-supplier=Element14; ComponentLink3Description: http://www.farnell.com/datasheets/2130008.pdf?src-supplier=Element14; ComponentLink4URL: https://product.tdk.com/info/en/catalog/datasheets/inductor_commercial_power_vls201610hbx-1_en.pdf?src-supplier=Digi-Key; ComponentLink4Description: https://product.tdk.com/info/en/catalog/datasheets/inductor_commercial_power_vls201610hbx-1_en.pdf?src-supplier=Digi-Key; ComponentLink5URL: https://product.tdk.com/info/en/catalog/datasheets/inductor_commercial_power_vls201610hbx-1_en.pdf?ref_disty=digikey&src-supplier=Digi-Key; ComponentLink5Description: https://product.tdk.com/info/en/catalog/datasheets/inductor_commercial_power_vls201610hbx-1_en.pdf?ref_disty=digikey&src-supplier=Digi-Key
R105 R108 R114 R115 R118 R125 R126 = Res_0402: as R49 on sheet 08_FPGA; ComponentLink1URL: http://www.yageo.com/documents/recent/PYu-RC_Group_51_RoHS_L_7.pdf; ComponentLink1Description: http://www.yageo.com/documents/recent/PYu-RC_Group_51_RoHS_L_7.pdf; Value: 0R; Supplier 1: Digi-Key; Supplier Part Number 1: 311-0.0NCT-ND; Stock 1: 6252381; Pricing 1: 1=0,10000, 10=0,03700, 25=0,02680, 50=0,02020, 100=0,01500, 250=0,01140, 500=0,00912, 1000=0,00672, 5000=0,00482 (USD); RoHS: Yes; Case/Package: 0201; Case Code (Metric): 0603; Case Code (Imperial): 0201; Weight: 6E-06oz; Contact Plating: Tin,Matte; Size Code: 0201; Min Operating Temperature: -55°C; Max Operating Temperature: 125°C; Packaging: Tape and Reel; Resistance: 0R; Package Quantity: 1; Resistor Type: Thick Film; Number of Terminations: 2; Termination: SMD/SMT; Max Power Dissipation: 50mW; Voltage Rating (DC): 25V; Features: Moisture Resistant; Series: RC; Construction: Rectangular; Resistance Tolerance: 5%; Length: 0.024inch; Width: 0.012inch; Height: 0.01inch; Depth: 0.3mm; Radiation Hardening: No; Military Standard: Not; Lead Free: Lead Free; RoHS Compliant: Yes; ComponentLink2URL: https://datasheet.ciiva.com/7672/1563626-7672248.pdf?src-supplier=Element14; ComponentLink2Description: https://datasheet.ciiva.com/7672/1563626-7672248.pdf?src-supplier=Element14; ComponentLink3URL: https://datasheet.ciiva.com/7672/1563626-7672247.pdf?src-supplier=Element14; ComponentLink3Description: https://datasheet.ciiva.com/7672/1563626-7672247.pdf?src-supplier=Element14; ComponentLink4URL: https://datasheet.ciiva.com/7660/1421516-7660808.pdf?src-supplier=Element14; ComponentLink4Description: https://datasheet.ciiva.com/7660/1421516-7660808.pdf?src-supplier=Element14; ComponentLink5URL: https://datasheet.ciiva.com/46391/1421516-46391340.pdf?src-supplier=Element14; ComponentLink5Description: https://datasheet.ciiva.com/46391/1421516-46391340.pdf?src-supplier=Element14
R106 = Res_0402: Manufacturer: Yageo; Manufacturer Part Number 1: RC0201FR-075K6L; Part Description: 5.6 kOhms ±1% 0.05W, 1/20W Chip Resistor 0201 (0603 Metric) Moisture Resistant Thick Film; Resistance: 5.6kR; Power Rating: 50mW; Voltage Rating: 25V; Temperature Coefficient: 200ppm/°C; Value: 5.6k, 1%; ComponentLink1URL: https://datasheet.ciiva.com/5924/1563626-5924912.pdf?src-supplier=Farnell; ComponentLink1Description: https://datasheet.ciiva.com/5924/1563626-5924912.pdf?src-supplier=Farnell; ComponentLink2URL: https://datasheet.ciiva.com/22661/1563626-22661319.pdf?src-supplier=Element14; ComponentLink2Description: https://datasheet.ciiva.com/22661/1563626-22661319.pdf?src-supplier=Element14; ComponentLink3URL: https://datasheet.ciiva.com/7660/1421516-7660807.pdf?src-supplier=Element14; ComponentLink3Description: https://datasheet.ciiva.com/7660/1421516-7660807.pdf?src-supplier=Element14; ComponentLink4URL: https://datasheet.ciiva.com/46391/1421516-46391339.pdf?src-supplier=Element14; ComponentLink4Description: https://datasheet.ciiva.com/46391/1421516-46391339.pdf?src-supplier=Element14; ComponentLink5URL: https://datasheet.ciiva.com/2467/pyu-r-int-thick-7-2467110.pdf?src-supplier=Digi-Key; ComponentLink5Description: https://datasheet.ciiva.com/2467/pyu-r-int-thick-7-2467110.pdf?src-supplier=Digi-Key; ComponentLink6URL: https://datasheet.ciiva.com/2467/pyu-r-int-thick-7-2467111.pdf?src-supplier=Digi-Key; ComponentLink6Description: https://datasheet.ciiva.com/2467/pyu-r-int-thick-7-2467111.pdf?src-supplier=Digi-Key; ComponentLink7URL: https://datasheet.ciiva.com/2467/pyu-r-int-thick-7-2467109.pdf?src-supplier=Digi-Key; ComponentLink7Description: https://datasheet.ciiva.com/2467/pyu-r-int-thick-7-2467109.pdf?src-supplier=Digi-Key; Supplier 1: Digi-Key; Supplier Part Number 1: YAG2346CT-ND; Stock 1: 808399; Pricing 1: 1=0,10000, 10=0,03700, 100=0,01500, 1000=0,00672, 2500=0,00583, 5000=0,00482 (USD); RoHS: Yes; Case/Package: 0201; Case Code (Metric): 0603; Case Code (Imperial): 0201; Min Operating Temperature: -55°C; Max Operating Temperature: 125°C; Package Quantity: 10000; Packaging: Tape and Reel; Tolerance: 1%; Resistor Type: Thick Film; Number of Terminations: 2; Termination: SMD/SMT; Max Power Dissipation: 50mW; Features: Moisture Resistant; Series: RC; Resistance Tolerance: 1%; Length: 0.024inch; Width: 0.3mm; Height: 0.01inch; Reach SVHC Compliant: Yes; RoHS Compliant: Yes; ComponentLink8URL: https://datasheet.ciiva.com/22661/1563626-22661325.pdf?src-supplier=Element14; ComponentLink8Description: https://datasheet.ciiva.com/22661/1563626-22661325.pdf?src-supplier=Element14
R107 R113 R117 R123 = Res_0402: as R34-R36 on sheet 08_FPGA; Value: 10k, 1%; ComponentLink1URL: https://datasheet.ciiva.com/5924/1563626-5924912.pdf?src-supplier=Farnell; ComponentLink1Description: https://datasheet.ciiva.com/5924/1563626-5924912.pdf?src-supplier=Farnell; ComponentLink2URL: https://datasheet.ciiva.com/22661/1563626-22661319.pdf?src-supplier=Element14; ComponentLink2Description: https://datasheet.ciiva.com/22661/1563626-22661319.pdf?src-supplier=Element14; Supplier 1: Digi-Key; Supplier Part Number 1: 311-10.0KMCT-ND; Stock 1: 17142315; Pricing 1: 1=0,10000, 10=0,03700, 100=0,01530, 1000=0,00685, 2500=0,00595, 5000=0,00491 (USD); RoHS: Yes; Case/Package: 0201; Number of Pins: 2; Case Code (Imperial): 0201; Case Code (Metric): 0603; Contact Plating: Tin,Matte; Weight: 6E-06oz; Min Operating Temperature: -55°C; Max Operating Temperature: 125°C; Tolerance: 1%; Packaging: Tape and Reel; Package Quantity: 10000; Termination: SMD/SMT; Resistor Type: Thick Film; Number of Terminations: 2; Max Power Dissipation: 50mW; Voltage Rating (DC): 25V; Features: Moisture Resistant; Series: RC; Resistance Tolerance: 1%; Construction: Rectangular; Working Voltage: 25V; Technology: THICK FILM; Length: 0.6mm; Width: 0.012inch; Height: 0.01inch; Depth: 0.3mm; Radiation Hardening: No; Reach SVHC Compliant: Yes; Military Standard: Not; Lead Free: Lead Free; RoHS Compliant: Yes; ComponentLink3URL: https://datasheet.ciiva.com/7660/1421516-7660807.pdf?src-supplier=Element14; ComponentLink3Description: https://datasheet.ciiva.com/7660/1421516-7660807.pdf?src-supplier=Element14; ComponentLink4URL: https://datasheet.ciiva.com/46391/1421516-46391339.pdf?src-supplier=Element14; ComponentLink4Description: https://datasheet.ciiva.com/46391/1421516-46391339.pdf?src-supplier=Element14; ComponentLink5URL: https://datasheet.ciiva.com/2467/pyu-r-int-thick-7-2467110.pdf?src-supplier=Digi-Key; ComponentLink5Description: https://datasheet.ciiva.com/2467/pyu-r-int-thick-7-2467110.pdf?src-supplier=Digi-Key; ComponentLink6URL: https://datasheet.ciiva.com/2467/pyu-r-int-thick-7-2467111.pdf?src-supplier=Digi-Key; ComponentLink6Description: https://datasheet.ciiva.com/2467/pyu-r-int-thick-7-2467111.pdf?src-supplier=Digi-Key; ComponentLink7URL: https://datasheet.ciiva.com/2467/pyu-r-int-thick-7-2467109.pdf?src-supplier=Digi-Key; ComponentLink7Description: https://datasheet.ciiva.com/2467/pyu-r-int-thick-7-2467109.pdf?src-supplier=Digi-Key
R109 R111 R119-R121 = Res_0402: Part Description: 3.3 kOhms ±1% 0.05W, 1/20W Chip Resistor 0201 (0603 Metric) Moisture Resistant Thick Film; Manufacturer: Yageo; Manufacturer Part Number 1: RC0201FR-073K3L; Resistance: 3.3kR; Power Rating: 50mW; Voltage Rating: 25V; Temperature Coefficient: 200ppm/°C; ComponentLink1URL: http://www.yageo.com/documents/recent/PYu-RC_Group_51_RoHS_L_7.pdf; ComponentLink1Description: http://www.yageo.com/documents/recent/PYu-RC_Group_51_RoHS_L_7.pdf; Value: 3k3, 1%; Supplier 1: Digi-Key; Supplier Part Number 1: YAG2285CT-ND; Stock 1: 586100; Pricing 1: 1=0,10000, 10=0,03700, 100=0,01500, 1000=0,00672, 2500=0,00583, 5000=0,00482 (USD); RoHS: Yes; Case/Package: 0201; Case Code (Metric): 0603; Case Code (Imperial): 0201; Min Operating Temperature: -55°C; Max Operating Temperature: 125°C; Tolerance: 1%; Packaging: Tape and Reel; Package Quantity: 10000; Resistor Type: Thick Film; Number of Terminations: 2; Termination: SMD/SMT; Max Power Dissipation: 50mW; Features: Moisture Resistant; Series: RC; Construction: Rectangular; Resistance Tolerance: 1%; Length: 0.024inch; Width: 0.3mm; Height: 0.01inch; Depth: 0.3mm; Military Standard: Not; RoHS Compliant: Yes; ComponentLink2URL: https://datasheet.ciiva.com/22698/1563626-22698524.pdf?src-supplier=Element14; ComponentLink2Description: https://datasheet.ciiva.com/22698/1563626-22698524.pdf?src-supplier=Element14; ComponentLink3URL: https://datasheet.ciiva.com/14985/pyu-r-int-thick-7-14985418.pdf?src-supplier=Digi-Key; ComponentLink3Description: https://datasheet.ciiva.com/14985/pyu-r-int-thick-7-14985418.pdf?src-supplier=Digi-Key
R110 = Res_0402: Part Description: 47 kOhms ±1% 0.05W, 1/20W Chip Resistor 0201 (0603 Metric) Moisture Resistant Thick Film; Manufacturer: Yageo; Manufacturer Part Number 1: RC0201FR-0747KL; Resistance: 47kR; Power Rating: 50mW; Voltage Rating: 25V; Temperature Coefficient: 200ppm/°C; ComponentLink1URL: http://www.yageo.com/documents/recent/PYu-RC_Group_51_RoHS_L_7.pdf; ComponentLink1Description: http://www.yageo.com/documents/recent/PYu-RC_Group_51_RoHS_L_7.pdf; Value: 47k, 1%; Supplier 1: Digi-Key; Supplier Part Number 1: 311-47KMCT-ND; Stock 1: 684352; Pricing 1: 1=0,10000, 10=0,03700, 100=0,01500, 1000=0,00672, 2500=0,00583, 5000=0,00482 (USD); RoHS: Yes; Case/Package: 0201; Case Code (Metric): 0603; Case Code (Imperial): 0201; Weight: 6E-06oz; Contact Plating: Tin,Matte; Size Code: 0201; Min Operating Temperature: -55°C; Max Operating Temperature: 125°C; Tolerance: 1%; Packaging: Tape and Reel; Package Quantity: 10000; Resistor Type: Thick Film; Number of Terminations: 2; Termination: SMD/SMT; Max Power Dissipation: 50mW; Features: Moisture Resistant; Series: RC; Resistance Tolerance: 1%; Construction: Rectangular; Length: 0.6mm; Width: 0.3mm; Height: 0.01inch; Depth: 0.3mm; Radiation Hardening: No; Military Standard: Not; Lead Free: Lead Free; RoHS Compliant: Yes; ComponentLink2URL: https://datasheet.ciiva.com/7672/1563626-7672232.pdf?src-supplier=Element14; ComponentLink2Description: https://datasheet.ciiva.com/7672/1563626-7672232.pdf?src-supplier=Element14; ComponentLink3URL: https://datasheet.ciiva.com/29710/pyu-r-int-thick-7-29710919.pdf?src-supplier=Digi-Key; ComponentLink3Description: https://datasheet.ciiva.com/29710/pyu-r-int-thick-7-29710919.pdf?src-supplier=Digi-Key; ComponentLink4URL: https://datasheet.ciiva.com/29710/pyu-r-int-thick-7-29710920.pdf?src-supplier=Digi-Key; ComponentLink4Description: https://datasheet.ciiva.com/29710/pyu-r-int-thick-7-29710920.pdf?src-supplier=Digi-Key; ComponentLink5URL: https://datasheet.ciiva.com/25647/pyu-r-int-thick-7-25647310.pdf?src-supplier=Digi-Key; ComponentLink5Description: https://datasheet.ciiva.com/25647/pyu-r-int-thick-7-25647310.pdf?src-supplier=Digi-Key; ComponentLink6URL: https://datasheet.ciiva.com/26829/getdatasheetpartid-422496-26829867.pdf?src-supplier=Verical; ComponentLink6Description: https://datasheet.ciiva.com/26829/getdatasheetpartid-422496-26829867.pdf?src-supplier=Verical; ComponentLink7URL: https://datasheet.ciiva.com/8889/pyu-rc0201-51-rohs-l-8-8889065.pdf?src-supplier=Avnet; ComponentLink7Description: https://datasheet.ciiva.com/8889/pyu-rc0201-51-rohs-l-8-8889065.pdf?src-supplier=Avnet
R112 = Res_0402: Manufacturer: Stackpole Electronics; Manufacturer Part Number 1: RMCF0201FT7K50; Part Description: 7.5 kOhms ±1% 0.05W, 1/20W Chip Resistor 0201 (0603 Metric) Thick Film; Resistance: 7.5kR; Max Power Dissipation: 50mW; Temperature Coefficient: 200ppm/°C; Value: 7.5k, 1%; ComponentLink1URL: https://datasheet.ciiva.com/5924/1563626-5924912.pdf?src-supplier=Farnell; ComponentLink1Description: https://datasheet.ciiva.com/5924/1563626-5924912.pdf?src-supplier=Farnell; ComponentLink2URL: https://datasheet.ciiva.com/22661/1563626-22661319.pdf?src-supplier=Element14; ComponentLink2Description: https://datasheet.ciiva.com/22661/1563626-22661319.pdf?src-supplier=Element14; ComponentLink3URL: https://datasheet.ciiva.com/7660/1421516-7660807.pdf?src-supplier=Element14; ComponentLink3Description: https://datasheet.ciiva.com/7660/1421516-7660807.pdf?src-supplier=Element14; ComponentLink4URL: https://datasheet.ciiva.com/46391/1421516-46391339.pdf?src-supplier=Element14; ComponentLink4Description: https://datasheet.ciiva.com/46391/1421516-46391339.pdf?src-supplier=Element14; ComponentLink5URL: https://datasheet.ciiva.com/2467/pyu-r-int-thick-7-2467110.pdf?src-supplier=Digi-Key; ComponentLink5Description: https://datasheet.ciiva.com/2467/pyu-r-int-thick-7-2467110.pdf?src-supplier=Digi-Key; ComponentLink6URL: https://datasheet.ciiva.com/2467/pyu-r-int-thick-7-2467111.pdf?src-supplier=Digi-Key; ComponentLink6Description: https://datasheet.ciiva.com/2467/pyu-r-int-thick-7-2467111.pdf?src-supplier=Digi-Key; ComponentLink7URL: https://datasheet.ciiva.com/2467/pyu-r-int-thick-7-2467109.pdf?src-supplier=Digi-Key; ComponentLink7Description: https://datasheet.ciiva.com/2467/pyu-r-int-thick-7-2467109.pdf?src-supplier=Digi-Key; Supplier 1: Digi-Key; Supplier Part Number 1: RMCF0201FT7K50CT-ND; Stock 1: 145930; Pricing 1: 1=0,10000, 10=0,02400, 100=0,00970, 1000=0,00437, 2500=0,00379, 5000=0,00313 (USD); RoHS: Yes; Mount: Surface Mount; Case/Package: 0201; Case Code (Metric): 0603; Case Code (Imperial): 0201; Contact Plating: Tin,Matte; Min Operating Temperature: -55°C; Max Operating Temperature: 125°C; Packaging: Tape and Reel; Tolerance: 1%; Package Quantity: 10000; Resistor Type: Thick Film; Number of Terminations: 2; Series: RMCF; Length: 0.024inch; Width: 0.012inch; Height: 0.009inch; Radiation Hardening: No; RoHS Compliant: Yes; ComponentLink8URL: https://www.seielect.com/catalog/SEI-Packaging.pdf?src-supplier=Digi-Key; ComponentLink8Description: https://www.seielect.com/catalog/SEI-Packaging.pdf?src-supplier=Digi-Key; ComponentLink9URL: https://www.seielect.com/Catalog/SEI-RMCF_RMCP.pdf?src-supplier=Digi-Key; ComponentLink9Description: https://www.seielect.com/Catalog/SEI-RMCF_RMCP.pdf?src-supplier=Digi-Key; ComponentLink10URL: https://www.seielect.com/catalog/SEI-RMCF_RMCP.pdf?src-supplier=Avnet; ComponentLink10Description: https://www.seielect.com/catalog/SEI-RMCF_RMCP.pdf?src-supplier=Avnet; ComponentLink11URL: http://www.seielect.com/Catalog/SEI-RMCF_RMCP.pdf?src-supplier=Digi-Key; ComponentLink11Description: http://www.seielect.com/Catalog/SEI-RMCF_RMCP.pdf?src-supplier=Digi-Key
R116 = Res_0402: as R74 on sheet 10_Clock; Value: 12.7k, 1%; ComponentLink1URL: https://datasheet.ciiva.com/5924/1563626-5924912.pdf?src-supplier=Farnell; ComponentLink1Description: https://datasheet.ciiva.com/5924/1563626-5924912.pdf?src-supplier=Farnell; ComponentLink2URL: https://datasheet.ciiva.com/22661/1563626-22661319.pdf?src-supplier=Element14; ComponentLink2Description: https://datasheet.ciiva.com/22661/1563626-22661319.pdf?src-supplier=Element14; ComponentLink3URL: https://datasheet.ciiva.com/7660/1421516-7660807.pdf?src-supplier=Element14; ComponentLink3Description: https://datasheet.ciiva.com/7660/1421516-7660807.pdf?src-supplier=Element14; ComponentLink4URL: https://datasheet.ciiva.com/46391/1421516-46391339.pdf?src-supplier=Element14; ComponentLink4Description: https://datasheet.ciiva.com/46391/1421516-46391339.pdf?src-supplier=Element14; ComponentLink5URL: https://datasheet.ciiva.com/2467/pyu-r-int-thick-7-2467110.pdf?src-supplier=Digi-Key; ComponentLink5Description: https://datasheet.ciiva.com/2467/pyu-r-int-thick-7-2467110.pdf?src-supplier=Digi-Key; ComponentLink6URL: https://datasheet.ciiva.com/2467/pyu-r-int-thick-7-2467111.pdf?src-supplier=Digi-Key; ComponentLink6Description: https://datasheet.ciiva.com/2467/pyu-r-int-thick-7-2467111.pdf?src-supplier=Digi-Key; ComponentLink7URL: https://datasheet.ciiva.com/2467/pyu-r-int-thick-7-2467109.pdf?src-supplier=Digi-Key; ComponentLink7Description: https://datasheet.ciiva.com/2467/pyu-r-int-thick-7-2467109.pdf?src-supplier=Digi-Key; Supplier 1: Digi-Key; Supplier Part Number 1: 311-12.7KMCT-ND; Stock 1: 49027; Pricing 1: 1=0,10000, 10=0,03700, 100=0,01500, 1000=0,00672, 2500=0,00583, 5000=0,00482 (USD); RoHS: Yes; Case/Package: 0201; Case Code (Metric): 0603; Case Code (Imperial): 0201; Min Operating Temperature: -55°C; Max Operating Temperature: 125°C; Package Quantity: 1; Tolerance: 1%; Packaging: Tape and Reel; Resistor Type: Thick Film; Number of Terminations: 2; Features: Moisture Resistant; Series: RC; Length: 0.024inch; Width: 0.012inch; Height: 0.01inch; RoHS Compliant: Yes; ComponentLink8URL: https://datasheet.ciiva.com/2493/pyu-r-int-thick-7-2493806.pdf?src-supplier=Digi-Key; ComponentLink8Description: https://datasheet.ciiva.com/2493/pyu-r-int-thick-7-2493806.pdf?src-supplier=Digi-Key; ComponentLink9URL: https://datasheet.ciiva.com/2493/pyu-r-int-thick-7-2493807.pdf?src-supplier=Digi-Key; ComponentLink9Description: https://datasheet.ciiva.com/2493/pyu-r-int-thick-7-2493807.pdf?src-supplier=Digi-Key; ComponentLink10URL: https://datasheet.ciiva.com/2493/pyu-r-int-thick-7-2493805.pdf?src-supplier=Digi-Key; ComponentLink10Description: https://datasheet.ciiva.com/2493/pyu-r-int-thick-7-2493805.pdf?src-supplier=Digi-Key
R122 = Res_0402: Manufacturer: Yageo; Manufacturer Part Number 1: RC0201FR-0731K6L; Part Description: 31.6 kOhms ±1% 0.05W, 1/20W Chip Resistor 0201 (0603 Metric) Moisture Resistant Thick Film; Resistance: 31.6kR; Max Power Dissipation: 50mW; Temperature Coefficient: 200ppm/°C; Value: 31.6k, 1%; ComponentLink1URL: https://datasheet.ciiva.com/5924/1563626-5924912.pdf?src-supplier=Farnell; ComponentLink1Description: https://datasheet.ciiva.com/5924/1563626-5924912.pdf?src-supplier=Farnell; ComponentLink2URL: https://datasheet.ciiva.com/22661/1563626-22661319.pdf?src-supplier=Element14; ComponentLink2Description: https://datasheet.ciiva.com/22661/1563626-22661319.pdf?src-supplier=Element14; ComponentLink3URL: https://datasheet.ciiva.com/7660/1421516-7660807.pdf?src-supplier=Element14; ComponentLink3Description: https://datasheet.ciiva.com/7660/1421516-7660807.pdf?src-supplier=Element14; ComponentLink4URL: https://datasheet.ciiva.com/46391/1421516-46391339.pdf?src-supplier=Element14; ComponentLink4Description: https://datasheet.ciiva.com/46391/1421516-46391339.pdf?src-supplier=Element14; ComponentLink5URL: https://datasheet.ciiva.com/2467/pyu-r-int-thick-7-2467110.pdf?src-supplier=Digi-Key; ComponentLink5Description: https://datasheet.ciiva.com/2467/pyu-r-int-thick-7-2467110.pdf?src-supplier=Digi-Key; ComponentLink6URL: https://datasheet.ciiva.com/2467/pyu-r-int-thick-7-2467111.pdf?src-supplier=Digi-Key; ComponentLink6Description: https://datasheet.ciiva.com/2467/pyu-r-int-thick-7-2467111.pdf?src-supplier=Digi-Key; ComponentLink7URL: https://datasheet.ciiva.com/2467/pyu-r-int-thick-7-2467109.pdf?src-supplier=Digi-Key; ComponentLink7Description: https://datasheet.ciiva.com/2467/pyu-r-int-thick-7-2467109.pdf?src-supplier=Digi-Key; Supplier 1: Digi-Key; Supplier Part Number 1: YAG2597CT-ND; Stock 1: 255391; Pricing 1: 1=0,10000, 10=0,03700, 100=0,01500, 1000=0,00672, 2500=0,00583, 5000=0,00482 (USD); RoHS: Yes; Case/Package: 0201; Case Code (Metric): 0603; Case Code (Imperial): 0201; Min Operating Temperature: -55°C; Max Operating Temperature: 125°C; Packaging: Tape and Reel; Resistor Type: Thick Film; Number of Terminations: 2; Tolerance: 1%; Features: Moisture Resistant; Length: 0.024inch; Width: 0.012inch; Height: 0.01inch; RoHS Compliant: Yes; ComponentLink8URL: http://www.yageo.com/documents/recent/PYu-RC_Group_51_RoHS_L_10.pdf?src-supplier=Digi-Key; ComponentLink8Description: http://www.yageo.com/documents/recent/PYu-RC_Group_51_RoHS_L_10.pdf?src-supplier=Digi-Key; ComponentLink9URL: https://www.yageo.com/upload/media/product/productsearch/datasheet/rchip/PYu-RC_Group_51_RoHS_L_11.pdf?src-supplier=Digi-Key; ComponentLink9Description: https://www.yageo.com/upload/media/product/productsearch/datasheet/rchip/PYu-RC_Group_51_RoHS_L_11.pdf?src-supplier=Digi-Key; ComponentLink10URL: http://www.yageo.com/documents/recent/PYu-RC_Group_51_RoHS_L_9.pdf?src-supplier=Digi-Key; ComponentLink10Description: http://www.yageo.com/documents/recent/PYu-RC_Group_51_RoHS_L_9.pdf?src-supplier=Digi-Key
R124 = Res_0402: as R40 on sheet 08_FPGA; ComponentLink1URL: http://www.yageo.com/documents/recent/PYu-RC_Group_51_RoHS_L_7.pdf; ComponentLink1Description: http://www.yageo.com/documents/recent/PYu-RC_Group_51_RoHS_L_7.pdf; Value: 100R, 1%; Supplier 1: Digi-Key; Supplier Part Number 1: 311-100MCT-ND; Stock 1: 1625377; Pricing 1: 1=0,10000, 10=0,03700, 100=0,01530, 1000=0,00685, 2500=0,00595, 5000=0,00491 (USD); RoHS: Yes; Case/Package: 0201; Case Code (Metric): 0603; Case Code (Imperial): 0201; Contact Plating: Tin,Matte; Size Code: 0201; Min Operating Temperature: -55°C; Max Operating Temperature: 125°C; Resistance: 100R; Tolerance: 1%; Packaging: Cut Tape; Package Quantity: 1; Resistor Type: Thick Film; Number of Terminations: 2; Termination: SMD/SMT; Max Power Dissipation: 50mW; Features: Moisture Resistant; Series: RC; Resistance Tolerance: 1%; Length: 0.024inch; Width: 0.012inch; Height: 0.01inch; Radiation Hardening: No; Lead Free: Lead Free; RoHS Compliant: Yes; ComponentLink2URL: https://datasheet.ciiva.com/2560/pyu-r-int-thick-7-2560866.pdf?src-supplier=Digi-Key; ComponentLink2Description: https://datasheet.ciiva.com/2560/pyu-r-int-thick-7-2560866.pdf?src-supplier=Digi-Key; ComponentLink3URL: https://datasheet.ciiva.com/2560/pyu-r-int-thick-7-2560867.pdf?src-supplier=Digi-Key; ComponentLink3Description: https://datasheet.ciiva.com/2560/pyu-r-int-thick-7-2560867.pdf?src-supplier=Digi-Key; ComponentLink4URL: https://datasheet.ciiva.com/2560/pyu-r-int-thick-7-2560865.pdf?src-supplier=Digi-Key; ComponentLink4Description: https://datasheet.ciiva.com/2560/pyu-r-int-thick-7-2560865.pdf?src-supplier=Digi-Key; ComponentLink5URL: https://datasheet.ciiva.com/8887/pyu-rc0201-51-rohs-l-8-8887865.pdf?src-supplier=Avnet; ComponentLink5Description: https://datasheet.ciiva.com/8887/pyu-rc0201-51-rohs-l-8-8887865.pdf?src-supplier=Avnet
R198 R199 R201 R202 = Res_0402: Manufacturer Part Number 1: RC0402JR-070RL; Manufacturer: Yageo; Part Description: RES SMD 0.0OHM JUMPER 1/16W 0402; Resistance (Ohms): 0.0; Tolerance: Jumper; Power (Watts): 0.063W, 1/16W; Value: 0R; Supplier 1: Digi-Key; Supplier Part Number 1: 311-0.0JRTR-ND; Category: Resistors; Temperature Coefficient: -; Features: Moisture Resistant; Supplier Device Package: 0402; Height: 0.016" (0.40mm); Package / Case: 0402 (1005 Metric); Operating Temperature: -55°C ~ 155°C; Size / Dimension: 0.039" L x 0.020" W (1.00mm x 0.50mm); Composition: Thick Film; Packaging: Tape & Reel (TR); Number of Terminations: 2; RoHS: RoHS Compliant